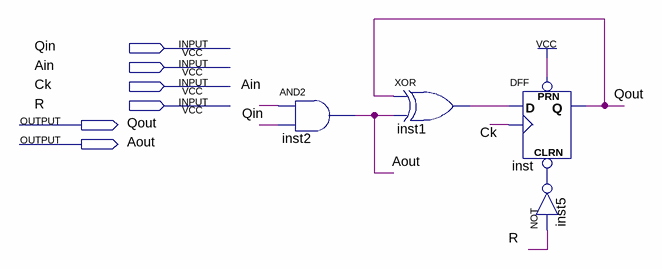
[diagram p0: schematic sheet]
// Quartus schematic ldm_upcounter_1bit.bdf as structural Verilog: 4 symbols, 6 pins
module ldm_upcounter_1bit (
  input  Qin,
  input  Ain,
  input  Ck,
  input  R,
  output Qout,
  output Aout
);

  wire inst1_out, inst5_out;

  and inst2 (Aout, Ain, Qin);
  xor inst1 (inst1_out, Qout, Aout);
  DFF inst (.CLRN(inst5_out), .CLK(Ck), .D(inst1_out), .PRN(1'b1), .Q(Qout));
  not inst5 (inst5_out, R);
endmodule
